# EAGLE design MySens-GWeasyRS485-v003_ProMicro (EAGLE 7.3.0)
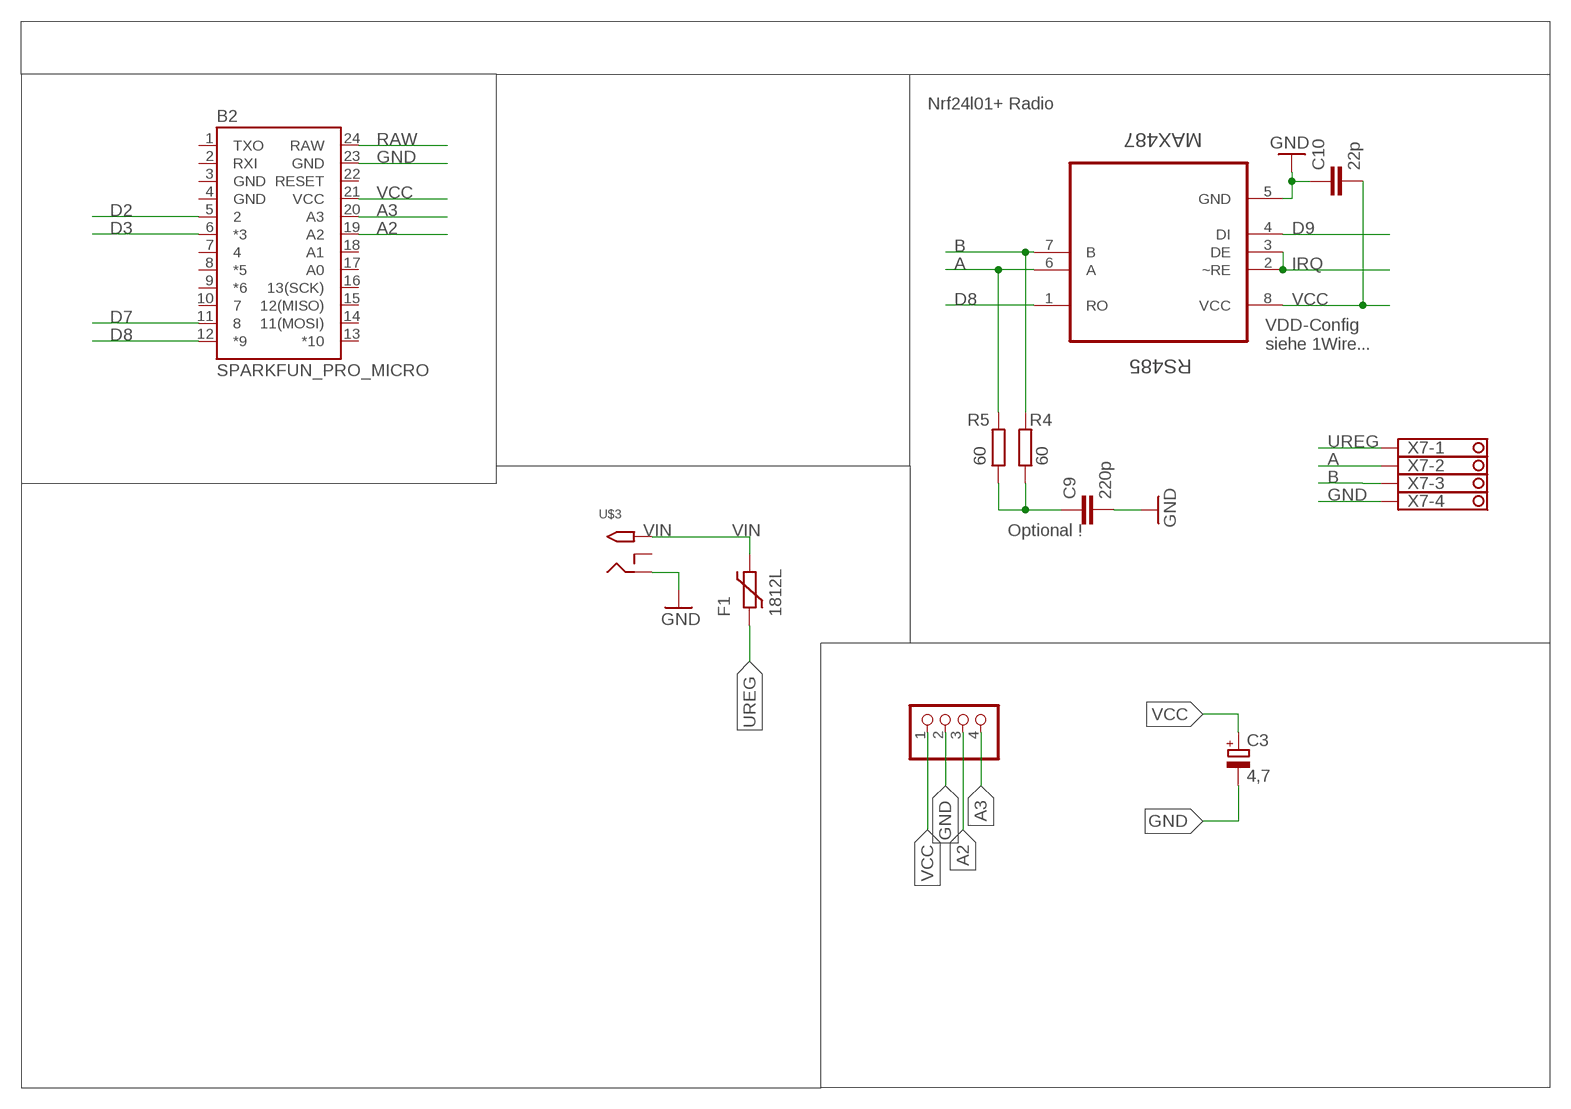
[diagram p0: schematic, sheet 1]

## Parts
B2  SPARKFUN_PRO_MICRO  [SPARKFUN_PRO_MICRO]
C3  4,7  CPOL-EUSMCC  [SMC_C]
C9  220p  C-EUC0805  [C0805]
C10  22p  C-EUC0805  [C0805]
F1  1812L  [1812L]
JP10  PINHD-1X04_2.54-S  [1X04-S]
R4  60  R-EU_R0805  [R0805]
R5  60  R-EU_R0805  [R0805]
RS485  MAX487  MAX487ECSA+  [SOIC127P600X175-8N]
U$3  2.1MMJACKTHM  [PJ-102A]
X7  1751264  [1751264]

## Nets
A: R5.2 RS485.6(A) X7.2
A2: B2.19(A2) JP10.3
A3: B2.20(A3) JP10.4
B: R4.2 RS485.7(B) X7.3
D2: B2.5
D3: B2.6(*3)
D7: B2.11
D8: B2.12(*9) RS485.1(RO)
D9: RS485.4(DI)
GND [Power]: B2.23(GND) C3.- C9.2 C10.1 JP10.2 RS485.5(GND) U$3.RING X7.4
IRQ: RS485.2(~RE) RS485.3(DE)
N$21: C9.1 R4.1 R5.1
RAW [Power]: B2.24(RAW)
UREG [Power]: F1.P$1 X7.1
VCC [Power]: B2.21(VCC) C3.+ C10.2 JP10.1 RS485.8(VCC)
VIN [Power]: F1.P$2 U$3.TIP
Unconnected: B2.1(TXO) B2.2(RXI) B2.7 B2.8(*5) B2.9(*6) B2.10 B2.13(*10) B2.14(11(MOSI)) B2.15(12(MISO)) B2.16(13(SCK)) B2.17(A0) B2.18(A1) B2.22(RESET) U$3.RING_SW

## Notes on the sheet
- Nrf24l01+ Radio
- VDD-Config
  siehe 1Wire...
- Optional !

## Power pins joined to a net without a drawn wire
GND: B2.3(GND) B2.4(GND)

## Library data of the parts
B2 = SparkFun-Boards:SPARKFUN_PRO_MICRO: SparkFun Pro Micro Atmega32U4 compatible footprint. SparkFun Products: 3.3V/8MHz <https://www.sparkfun.com/products/12587> 5V/16MHz <https://www.sparkfun.com/products/12640>
C3 = rcl:CPOL-EU: POLARIZED CAPACITOR, European symbol
C9 C10 = rcl:C-EU: CAPACITOR, European symbol
F1 = ptc-littlefuse:1812L
JP10 = pinhead-2:PINHD-1X04: PIN HEADER
R4 R5 = rcl:R-EU_: RESISTOR, European symbol
RS485 = Maxim_By_element14_Batch_1:MAX487ECSA+: Low-Power, Slew-Rate-Limited RS-485/RS-422 Transceivers; MPN: MAX487ECSA+; OC_FARNELL: 9724532; OC_NEWARK: 68K4803; PACKAGE: SOIC-8; SUPPLIER: Maxim
U$3 = adafruit:2.1MMJACK: 2.1mm x 5.5mm THM DC jack with internal switch. Digikey part #PJ-102A, 4UCON part #05537 2.1mm x 5.5mm SMT DC jack with internal switch. Digikey part #PJ-002A-SMT, 4UCON part #03267 By microbuilder.eu & adafruit.com
X7 = con-phoenix-350:1751264: MKDS 1/ 4-3,5 Printklemme Nennstrom: 10 A Bemessungsspannung: 160 V Raster: 3,5 mm Polzahl: 4 Montageart: Löten Anschlussart: Schraubanschluss Anschlussrichtung vom Leiter zur Platine: 0° Source: http://eshop.phoenixcontact.com .. 1751264.pdf; MPN: 1751264; OC_FARNELL: unknown; OC_NEWARK: 10R0934

## Net classes
0 default: width 0.305 mm
1 Power: width 0.508 mm

## Board
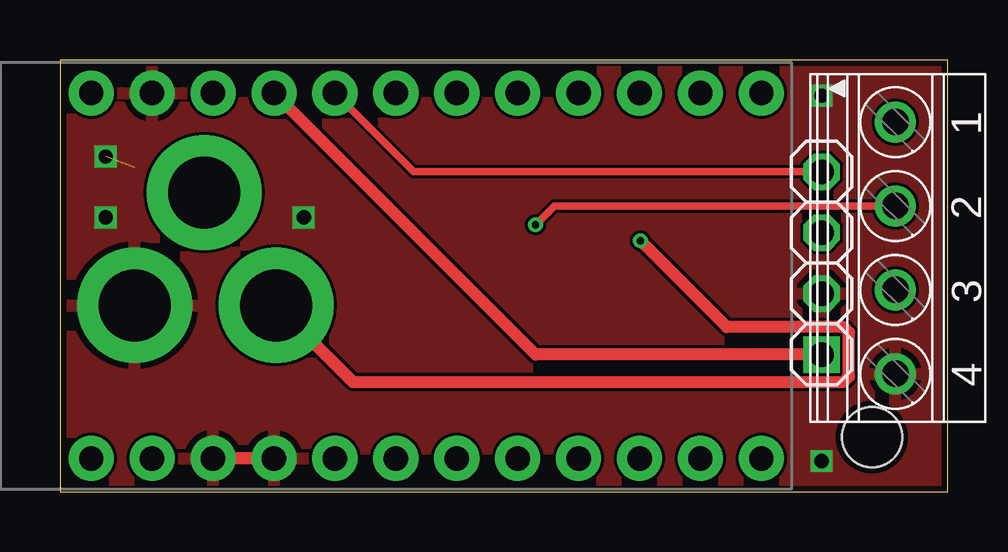
[diagram p1: board, top side]
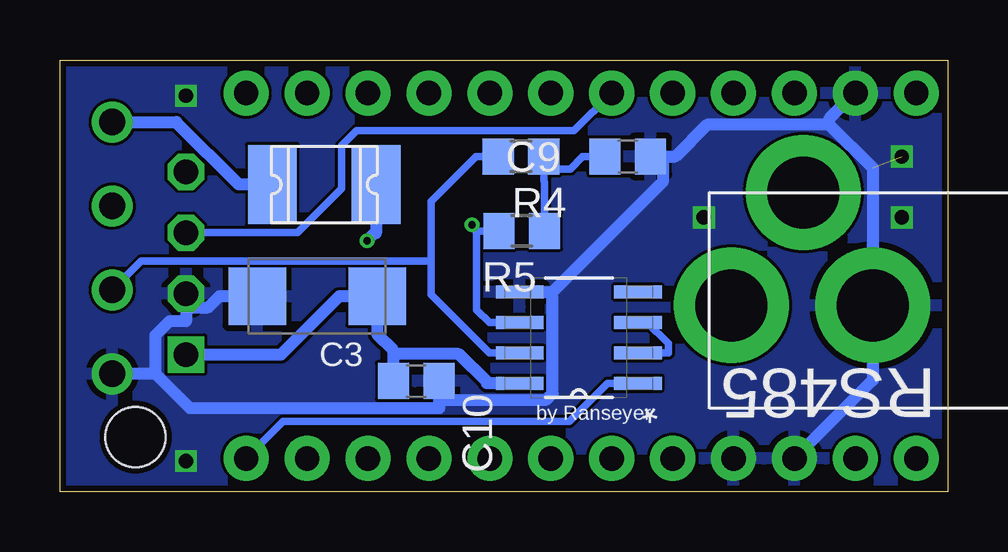
[diagram p2: board, bottom side, seen from below]

Size 37 x 18 mm. Coordinates in mm from the lower left corner, seen from the top.
Outline: 0,0 37,0 37,18 0,18 0,0
Copper layers (1*16): Top 0.035mm / dielectric 1.5mm / Bottom 0.035mm
Design rules "dirt_cheap_dirty_boards.v1": minimum track width 5mil, minimum drill 12mil, track to track 5mil, track to pad 5mil, pad to pad 5mil, via to via 5mil, smd to smd 0mil, copper to edge 10mil, drill to drill 10mil, minimum pad ring 10mil, minimum via ring 6mil, stop-mask expansion 2mil, vias tented up to drill 25mil, thermal gap 10mil
Holes 2.5 mm at 33.85,2.27

### Footprints (pad centres in the part's own frame; a part is rotated, then mirrored left to right if it is on the bottom)
SPARKFUN_PRO_MICRO = drill 1.016 pad 1.88: 1 -7.62,12.7; 2 -7.62,10.16; 3 -7.62,7.62; 4 -7.62,5.08; 5 -7.62,2.54; 6 -7.62,0; 7 -7.62,-2.54; 8 -7.62,-5.08; 9 -7.62,-7.62; 10 -7.62,-10.16; 11 -7.62,-12.7; 12 -7.62,-15.24; 13 7.62,-15.24; 14 7.62,-12.7; 15 7.62,-10.16; 16 7.62,-7.62; 17 7.62,-5.08; 18 7.62,-2.54; 19 7.62,0; 20 7.62,2.54; 21 7.62,5.08; 22 7.62,7.62; 23 7.62,10.16; 24 7.62,12.7
SMC_C = smd 2.4 x 2.4: + -2.5,0; - 2.5,0
C0805 = smd 1.3 x 1.5: 1 -0.95,0; 2 0.95,0
1812L = smd 2.03 x 3.3: P$1 -2.16,0; P$2 2.16,0
1X04-S = drill 1.016 square: 1 -3.81,0 | drill 1.016 octagon: 2 -1.27,0; 3 1.27,0; 4 3.81,0
R0805 = smd 1.3 x 1.5: 1 -0.95,0; 2 0.95,0
SOIC127P600X175-8N = smd 1.981 x 0.533: 1 -2.464,1.905; 2 -2.464,0.635; 3 -2.464,-0.635; 4 -2.464,-1.905; 5 2.464,-1.905; 6 2.464,-0.635; 7 2.464,0.635; 8 2.464,1.905
PJ-102A = drill 3 pad 4.8: RING 0.1,-3.39; RING_SW -4.6,-6.29; TIP 0.1,-9.29
1751264 = drill 1.1 pad 1.7: 1 -5.25,-0.1; 2 -1.75,-0.1; 3 1.75,-0.1; 4 5.25,-0.1

### Placement (x,y rotation side)
B2  14,9 90 top
C3  26.28,8.14 180 bottom
C9  13.34,13.97 0 bottom
C10  22.14,4.61 180 bottom
F1  25.98,12.8 0 bottom
JP10  31.75,9.53 90 top
R4  17.78,13.97 180 bottom
R5  17.75,10.88 180 bottom
RS485  15.37,6.42 180 bottom
U$3  -0.28,7.87 270 bottom
X7  34.92,10.16 270 top

### Tracks (layer width: path | path; a pad name or v marks a point on that pad's centre or on a via)
A  (via drill 0.3 pad 0.61)
  Top 0.305: X7.2 20.61,11.91 v19.82,11.12
  Bottom 0.305: RS485.6 19.1,7.05 19.63,7.58 19.63,10.88 | R5.2 19.63,10.88 | v19.82,11.12 19.63,10.93 19.63,10.88
A2
  Bottom 0.305: JP10.3 27.09,10.79 25.26,12.63 25.26,14.44 24.64,15.05 15.57,15.05 B2.19
A3
  Top 0.305: JP10.4 14.74,13.34 B2.20
B
  Bottom 0.305: 21.54,9.62 21.54,8.22 19.1,5.79 RS485.7 | R4.2 19.66,13.97 21.54,12.09 21.54,9.62 | X7.3 33.62,9.62 21.54,9.62
D8
  Bottom 0.305: RS485.1 14.18,4.51 15.77,2.92 27.7,2.92 B2.12
GND  (via drill 0.6)  (1 unrouted)
  Top 0.508: B2.4 B2.3
  Bottom 0.508: C3.- 30.36,8.14 30.82,7.68 31.75,7.68 | 31.75,7.68 31.75,7.11 32.42,7.11 33.01,6.52 33.01,4.91 | JP10.2 31.75,7.68 | 33.01,4.91 X7.4 | 33.01,4.91 31.57,3.47 21.2,3.47 21.2,3.83 | 11.87,13.97 11.87,12.92 16.46,8.32 | 11.87,13.97 11.35,13.97 10.03,15.3 4.97,15.3 4.94,15.33 | C9.2 11.87,13.97 | RS485.5 16.46,8.32 | 21.2,3.83 16.72,3.83 16.46,4.09 16.46,8.32 | C10.1 21.2,3.83 | B2.23 4.94,15.52 4.94,15.33 | 4.94,15.33 3.11,13.51 U$3.RING 3.11,4.65 B2.3
  other vias: 1.91,13.97 1.91,11.43 31.75,1.27 31.75,16.51 10.16,11.43
  pour Top: 0,17.78 36.83,17.78 36.83,0 0,0
  pour Bottom: 0,17.78 0,0 36.83,0 36.83,17.78
IRQ
  Bottom 0.305: RS485.2 11.64,5.79 11.64,6.17 12.52,7.05 RS485.3
N$21
  Bottom 0.305: C9.1 15.21,13.97 15.73,13.46 16.83,13.46 | 16.83,13.46 16.83,12.94 16.8,12.91 R5.1 | R4.1 16.83,13.46
UREG
  Bottom 0.508: F1.P$1 29.54,12.8 32.15,15.41 X7.1
VCC
  Top 0.508: JP10.1 19.82,5.71 B2.21
  Bottom 0.508: 23.09,5.74 23.09,5.88 23.78,6.56 C3.+ 25.36,8.14 27.78,5.71 JP10.1 | 23.09,5.74 23.09,5.58 C10.2 | RS485.8 19.2,4.51 19.2,4.56 20.38,5.74 23.09,5.74
VIN  (via drill 0.3 pad 0.61)
  Top 0.508: U$3.TIP 12.21,4.57 32.67,4.57 32.89,4.79 32.89,6.64 32.67,6.86 27.8,6.86 v24.2,10.46
  Bottom 0.508: F1.P$2 23.82,10.77 23.89,10.77 v24.2,10.46

### Text on the board
bPlace: by Ranseyer